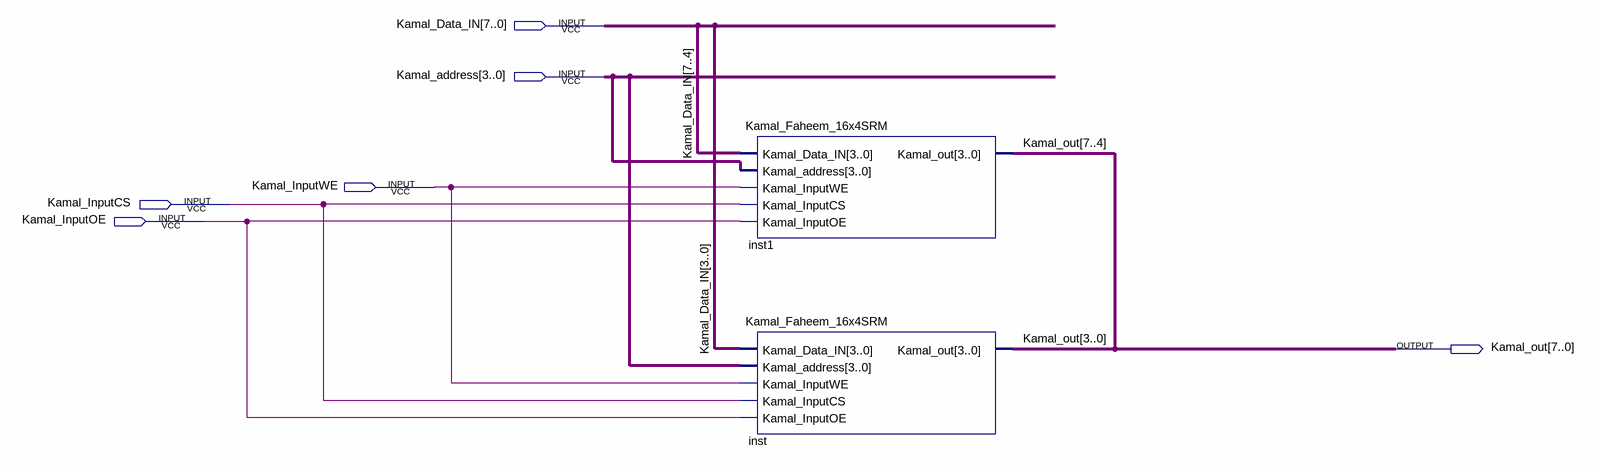
[diagram p0: schematic sheet]
// Quartus schematic Kamal_Faheem_16x8SRAM.bdf as structural Verilog: 2 symbols, 6 pins
module Kamal_Faheem_16x8SRAM (
  input  [7:0] Kamal_Data_IN,
  input  [3:0] Kamal_address,
  input  Kamal_InputWE,
  input  Kamal_InputCS,
  input  Kamal_InputOE,
  output [7:0] Kamal_out
);

  Kamal_Faheem_16x4SRM inst1 (
    .Kamal_Data_IN(Kamal_Data_IN[7:4]), .Kamal_address(Kamal_address), .Kamal_InputWE(Kamal_InputWE),
    .Kamal_InputCS(Kamal_InputCS), .Kamal_InputOE(Kamal_InputOE), .Kamal_out(Kamal_out[7:4]));
  Kamal_Faheem_16x4SRM inst (
    .Kamal_Data_IN(Kamal_Data_IN[3:0]), .Kamal_address(Kamal_address), .Kamal_InputWE(Kamal_InputWE),
    .Kamal_InputCS(Kamal_InputCS), .Kamal_InputOE(Kamal_InputOE), .Kamal_out(Kamal_out[3:0]));
endmodule
